# Altium schematic sheet Battery_Monitor.SchDoc: Battery Monitor
size A4; Organization: TechLabs Global Pvt Ltd; DocumentNumber: 3; Revision: 1.0; SheetNumber: 3; SheetTotal: 3
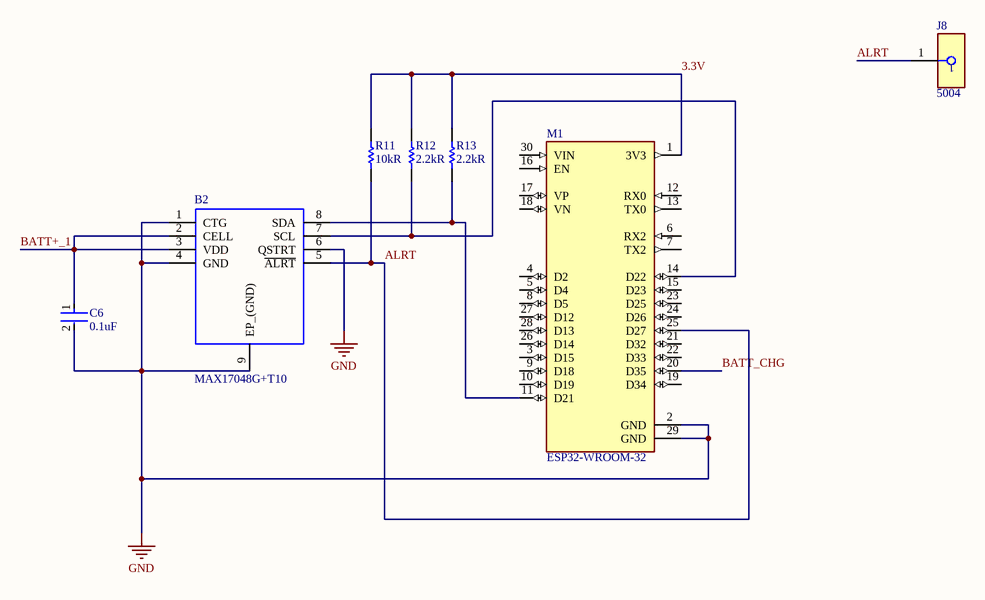
[diagram p0: Battery_Monitor.SchDoc]

## Parts
B2  MAX17048G+T10  [SON50P200X200X80-9N-D]
C6  0.1uF  [FP-CC0402-MFG]
J8  5004  [FP-5004-MFG]
M1  ESP32-WROOM-32  [ESP32-DEVKIT-V1]
R11  10kR  [RESC1005X40X25LL05T10]
R12  2.2kR  [RESC1005X40X25ML05T10]
R13  2.2kR  [RESC1005X40X25ML05T10]

## Nets
GND: B2.1(CTG) B2.4(GND) B2.6(QSTRT) B2.9(EP_(GND)) C6.2 M1.2(GND) M1.29(GND)
3.3V: M1.1(3V3) R11.2 R12.2 R13.2
ALRT: B2.5(~{ALRT}) J8.1 M1.25(D27) R11.1
BATT+_1: B2.2(CELL) B2.3(VDD) C6.1
BATT_CHG: M1.20(D35)
NetB2_7: B2.7(SCL) M1.14(D22) R12.1
NetB2_8: B2.8(SDA) M1.11(D21) R13.1

Not connected (* = marked no-connect by the designer): M1 3(D15) 4(D2) 5(D4) 6(RX2) 7(TX2) 8(D5) 9(D18) 10(D19) 12(RX0) 13(TX0) 15(D23) 16(EN) 17(VP) 18(VN) 19(D34) 21(D32) 22(D33) 23(D25) 24(D26) 26(D14) 27(D12) 28(D13) 30(VIN)

## Notes on the sheet
- Title
- Size:
- Date:
- A4
- Number:
- Time:
- Revision:
- Sheet
- of
- File:

## Library data of the parts
B2 = MAX17048G+T10: Battery Management Host-Side Modelgauge (1-Cell); Manufacturer: Maxim Integrated; Geometry.Height: 0.8mm; Mfr. Part #: MAX17048G+T10; Mouser Part Number: 700-MAX17048G+T10; Mouser Price/Stock: https://www.mouser.co.uk/ProductDetail/Maxim-Integrated/MAX17048G%2bT10?qs=D7PJwyCwLAoGnnn8jEPRBQ%3D%3D; Arrow Part Number: MAX17048G+T10; Arrow Price/Stock: https://www.arrow.com/en/products/max17048gt10/maxim-integrated?region=nac; Mouser Testing Part Number: *; Mouser Testing Price/Stock: *; Datasheet Link: https://datasheets.maximintegrated.com/en/ds/MAX17048-MAX17049.pdf; LCSC Part #: C2682616; Package: TDFN-8_EP; Digi-Key Part #: MAX17048G+T10TR-ND
C6 = CMP-03422-000773-1: CAP CER 0.1UF 16V X5R 0402; Mfr. Part #: CC0402KRX5R7BB104; Manufacturer: YAGEO; Capacitance: 100 nF; Automotive Grade: NA; Temperature Coefficient: 30ppm/°C; Tolerance: 0.1; Material: Ceramic; Footprint Url: http://www.yageo.com/exep/pages/download/literatures/UPY-C_GEN_24.pdf; ComponentLink2Description: Datasheet; Digikey Description: CAP CER 0.1UF 16V X5R 0402; ComponentLink2URL: http://www.yageo.com/documents/recent/UPY-GP_NP0_16V-to-50V_16.pdf; Device Class L1: Passive Components; Temperature Range High: +125°C; Temperature Range Low: -55°C; Temperature: -55°C to +125°C; Temperature Characteristic: X5R; Octopart: https://octopart.com/cc0402krx5r7bb104-yageo-8376508; Device Class L2: Capacitors; Value: 0.1uF; Voltage Rating: 16 V; Automotive: No; Lead Free: Yes; Height: 0.55mm; Device Class L3: Ceramic Capacitors; Package: CC0402; Mouser Description: Multilayer Ceramic Capacitors MLCC - SMD/SMT 100nF 16V X5R 10%; Ipc Land Pattern Name: CAPC10050X50; RoHS: TRUE; Category: Cap; LCSC Part #: C106204; Digi-Key Part #: 311-1347-2-ND
J8 = CMP-2000-05575-2: PC TEST POINT MINIATURE YELLOW; Manufacturer: Keystone; Number Of Contacts: 1; Is Female: yes; Device Class L1: Connectors; Mfr. Part #: 5004; Digikey Description: PC TEST POINT MINIATURE YELLOW; ComponentLink2URL: https://www.keyelco.com/product-pdf.cfm?p=1313; Lead Free: Yes; ComponentLink2Description: Datasheet; Category: Conn; Height: 4.72mm; Octopart: https://octopart.com/5004-keystone-28591; Mouser Description: TEST POINT PC MINI .040"D YELLOW; Device Class L3: unset; Contact Material: Silver; Package: 5004; Automotive: No; Device Class L2: unset; RoHS: TRUE; LCSC Part #: C2906762; Digi-Key Part #: 36-5004-ND
M1 = ESP32-DEVKIT-V1: Dual core, Wi-Fi: 2.4 GHz up to 150 Mbits/s,BLE (Bluetooth Low Energy) and legacy Bluetooth, 32 bits, Up to 240 MHz
R11 = CMP-2002-07353-1: 50V 10kΩ Thick Film Resistors 62.5mW ±1% -55℃~+155℃ ±100ppm/℃ 0402 Chip Resistor - Surface Mount ROHS; Mfr. Part #: RC0402FR-0710KL; Manufacturer: Yageo / Phycomp; LCSC Part #: C60490; Package: 0402; Power (Watts): 62.5mW; Tolerance: 1%; Value: 10kR; Digi-Key Part #: 311-10.0KLRTR-ND
R12 R13 = CMP-2002-07567-1: 62.5mW Thick Film Resistors 50V ±100ppm/℃ ±1% -55℃~+155℃ 2.2kΩ 0402 Chip Resistor - Surface Mount ROHS; Manufacturer: Yageo / Phycomp; Mfr. Part #: RC0402FR-072K2L; Power (Watts): 63mW; LCSC Part #: C114762; Package: 0402; Tolerance: 1%; Value: 2.2kR; Digi-Key Part #: 311-2.20KLRTR-ND